# EAGLE design power (EAGLE 7.6.0)
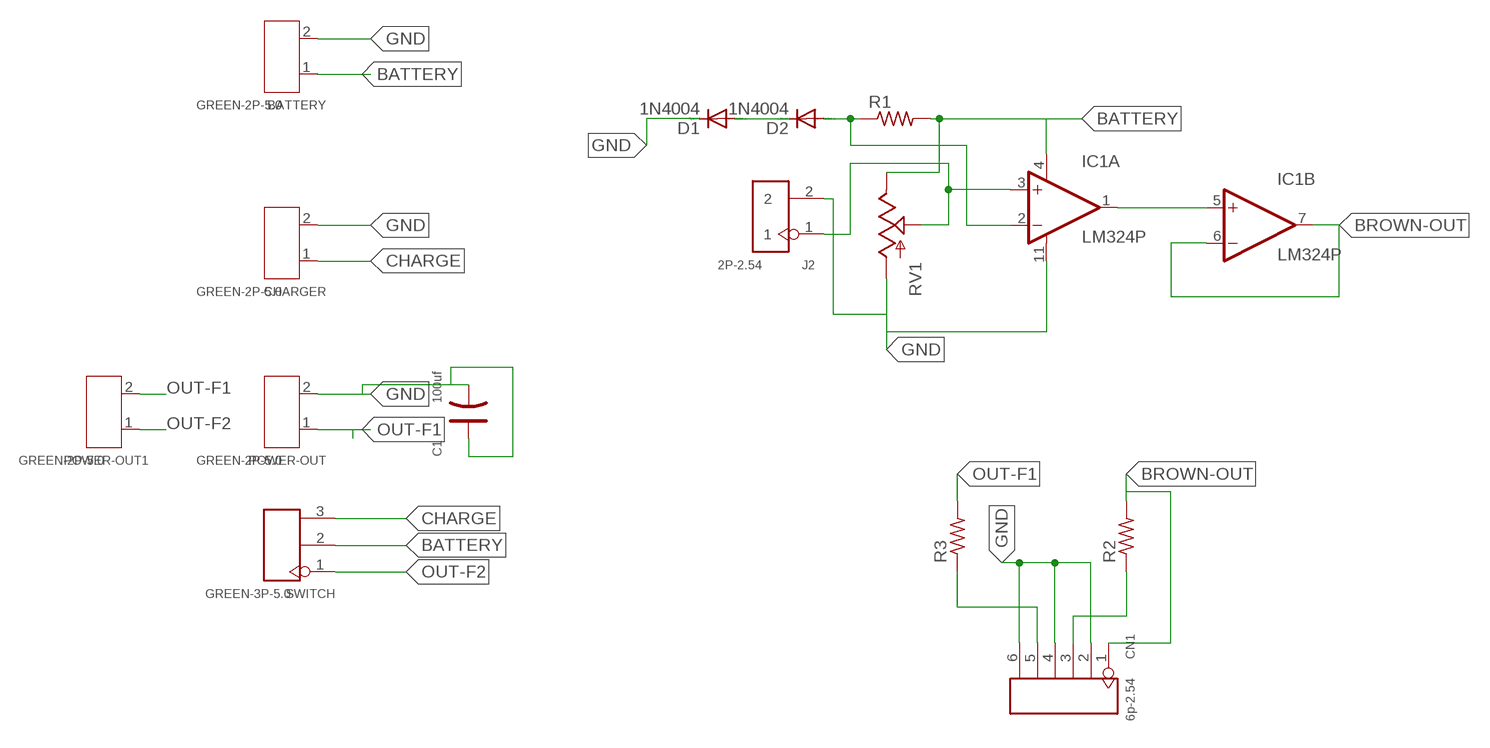
[diagram p0: schematic, sheet 1]

## Parts
BATTERY  GREEN-2P-5.0  SCREW-TERMINAL-GREEN(2P-5.0)  [H2-5.0-10.5X8.0MM]
C1  100uf  DIP-ALUMINUM-100UF-16V(D5-H7MM)  [PC-D5.3MM]
CHARGER  GREEN-2P-5.0  SCREW-TERMINAL-GREEN(2P-5.0)  [H2-5.0-10.5X8.0MM]
CN1  6p-2.54  DIP-BLACK-FEMALE-HEADER-VERT(6P-2.54)  [H6-2.54]
D1  1N4004  [DO41-10]
D2  1N4004  [DO41-10]
IC1  LM324P  [DIL14]
J2  2P-2.54  DIP-WHITE-MALE-HEADER-VERT(2P-2.54)  [H2-2.54]
POWER-OUT  GREEN-2P-5.0  SCREW-TERMINAL-GREEN(2P-5.0)  [H2-5.0-10.5X8.0MM]
POWER-OUT1  GREEN-2P-5.0  SCREW-TERMINAL-GREEN(2P-5.0)  [H2-5.0-10.5X8.0MM]
R1  R-US_0207/10  [0207/10]
R2  R-US_0207/10  [0207/10]
R3  R-US_0207/10  [0207/10]
RV1  POTTRIM  [TRIM_POT]
SWITCH  GREEN-3P-5.0  SCREW-TERMINAL-GREEN(3P-5.0)  [H3-5.0-15.5X8.0MM]

## Nets
BATTERY: BATTERY.1 IC1.4(A:V+) R1.2 RV1.2(E) SWITCH.2
BROWN-OUT: CN1.1 IC1.6(B:-IN) IC1.7(B:OUT) R2.2
CHARGE: CHARGER.1 SWITCH.3
GND: BATTERY.2 C1.+ C1.- CHARGER.2 CN1.2 CN1.4 CN1.6 D1.C IC1.11(A:V-) J2.2 POWER-OUT.2 RV1.3(A)
N$1: CN1.5 R3.1
N$2: D1.A D2.C
N$3: D2.A IC1.2(A:-IN) R1.1
N$4: IC1.3(A:+IN) J2.1 RV1.1(S)
N$5: IC1.1(A:OUT) IC1.5(B:+IN)
N$6: CN1.3 R2.1
OUT-F1: POWER-OUT1.2 POWER-OUT.1 R3.2
OUT-F2: POWER-OUT1.1 SWITCH.1
Unconnected: IC1.8(C:OUT) IC1.9(C:-IN) IC1.10(C:+IN) IC1.12(D:+IN) IC1.13(D:-IN) IC1.14(D:OUT)

## Library data of the parts
BATTERY CHARGER POWER-OUT POWER-OUT1 = Seeed-Connector -2016:SCREW-TERMINAL-GREEN(2P-5.0): 320110031
C1 = Seeed-Capacitor-2016:DIP-ALUMINUM-100UF-16V(D5-H7MM): 302030031; MPN: KS 100uF/16V
CN1 = Seeed-Connector -2016:DIP-BLACK-FEMALE-HEADER-VERT(6P-2.54): 320030060; MPN: F185-1106A1BSYC1
D1 D2 = diode:1N4004: DIODE general purpose rectifier, 1 A
IC1 = lm324:LM324: Low Power, Precision FET-Input Operational Amplifiers
J2 = Seeed-Connector -2016:DIP-WHITE-MALE-HEADER-VERT(2P-2.54): 320020037; MPN: P125-1102A0BS116A3
R1-R3 = adafruit:R-US_: RESISTOR, American symbol
RV1 = SparkFun-Electromechanical:POT
SWITCH = Seeed-Connector -2016:SCREW-TERMINAL-GREEN(3P-5.0): 320110029

## Board
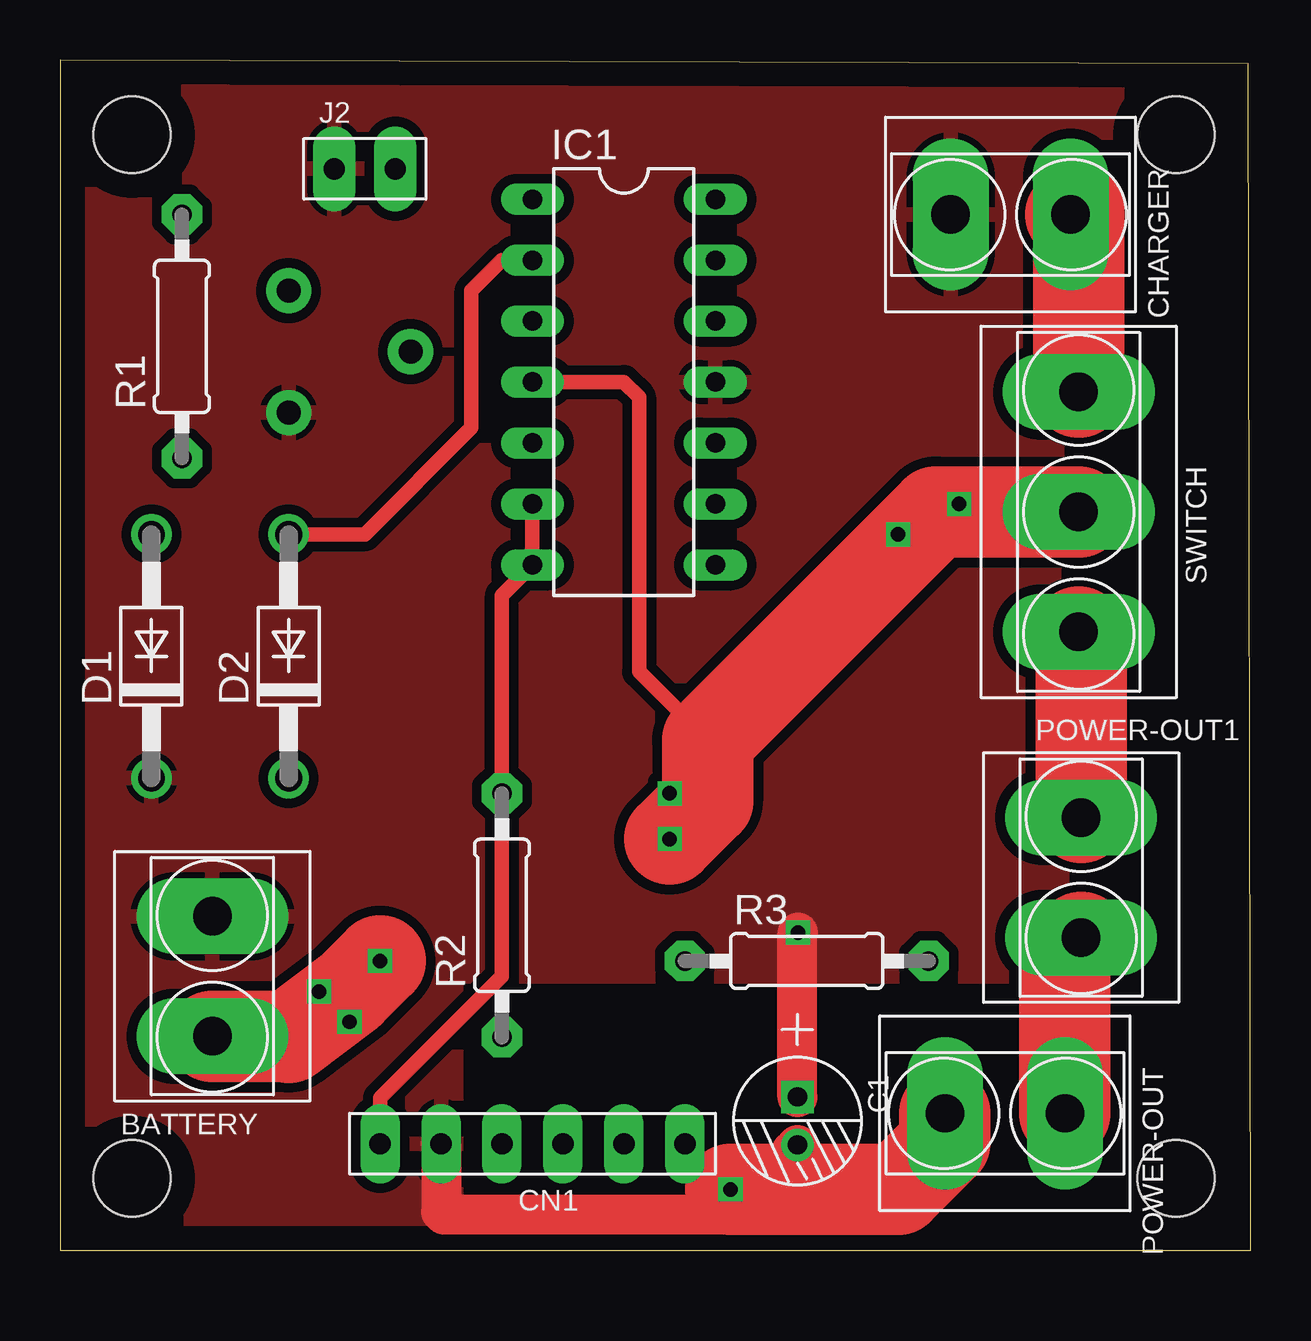
[diagram p1: board, top side]
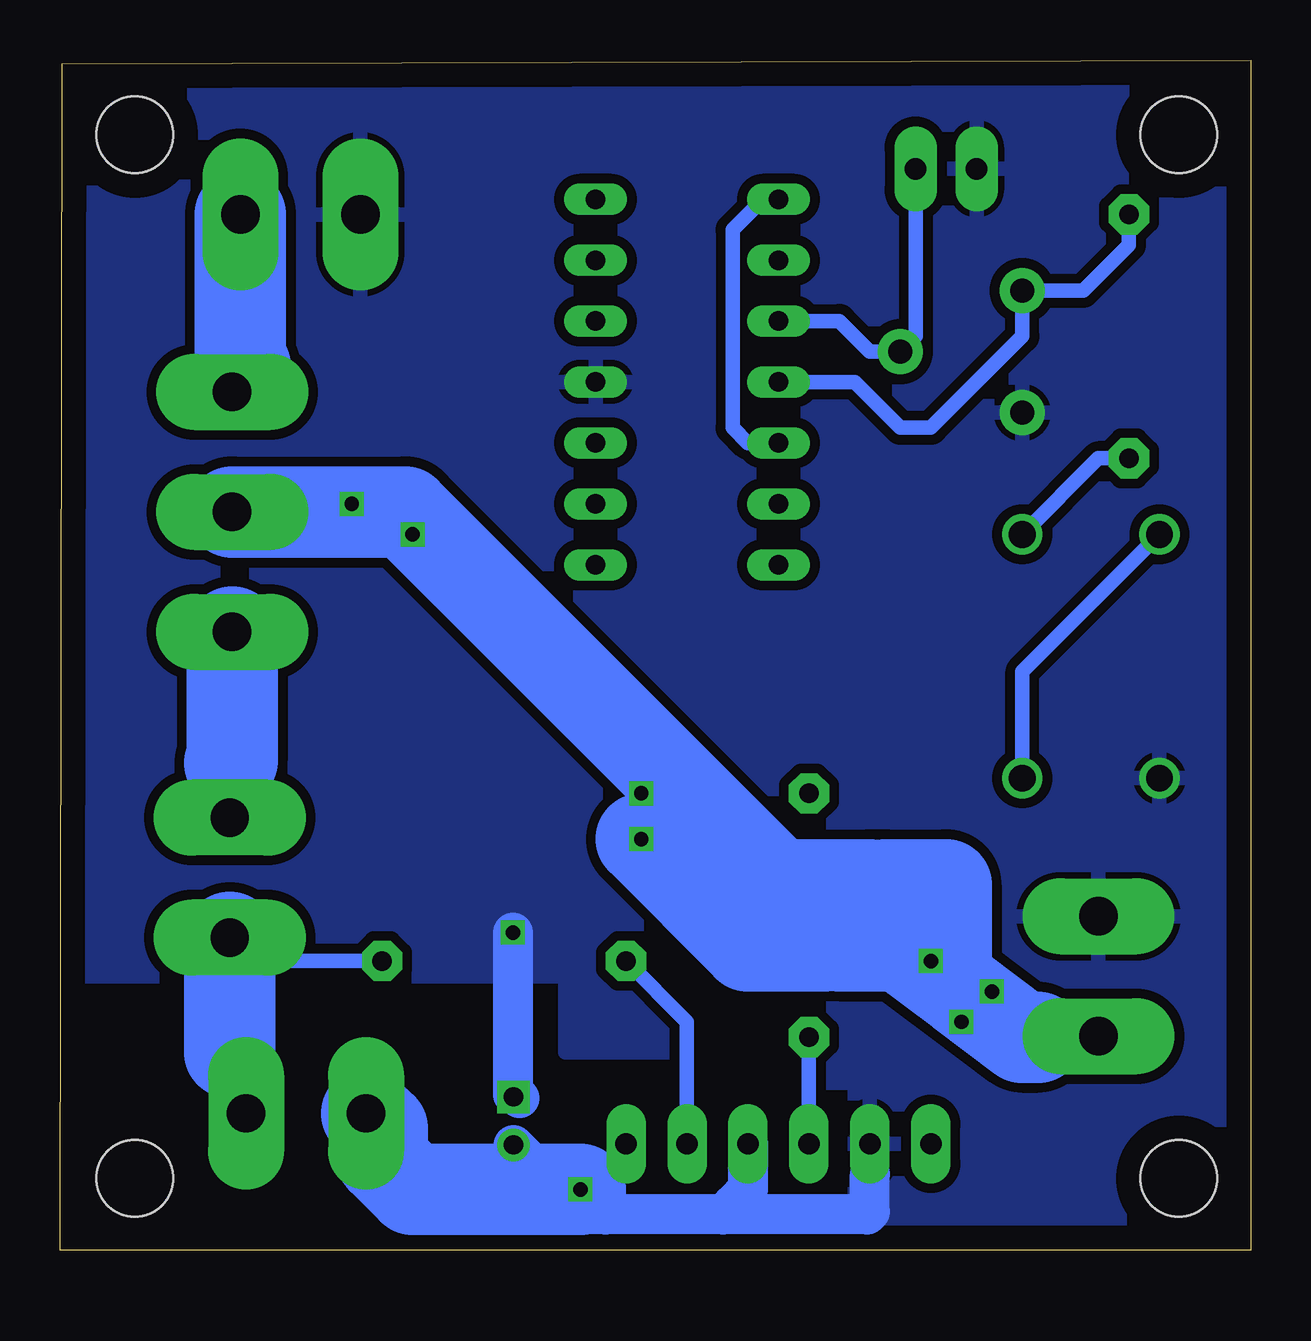
[diagram p2: board, bottom side, seen from below]

Size 49.62 x 49.62 mm. Coordinates in mm from the lower left corner, seen from the top.
Outline: 0,0 49.62,0 49.52,49.47 0,49.62 0,0
Copper layers (1*16): Top 0.035mm / dielectric 1.5mm / Bottom 0.035mm
Design rules "default": minimum track width 10mil, minimum drill 24mil, track to track 8mil, track to pad 8mil, pad to pad 8mil, via to via 8mil, smd to smd 8mil, copper to edge 40mil, drill to drill 8mil, minimum pad ring 10mil, minimum via ring 8mil, stop-mask expansion 4mil, vias tented up to drill 0mil, thermal gap 10mil
Holes 3.2 mm at 3,3 3,46.5 46.5,46.5 46.5,3

### Footprints (pad centres in the part's own frame; a part is rotated, then mirrored left to right if it is on the bottom)
H2-5.0-10.5X8.0MM = drill 1.6 pad 3.175 long: 1 0,2.5; 2 0,-2.5
PC-D5.3MM = drill 0.8 pad 1.35 square: + -1,0 | drill 0.8 pad 1.35: - 1,0
H6-2.54 = drill 0.889 pad 1.651 long: 1 0,6.35; 2 0,3.81; 3 0,1.27; 4 0,-1.27; 5 0,-3.81; 6 0,-6.35
DO41-10 = drill 1.118: A 5.08,0; C -5.08,0
DIL14 = drill 0.813 long: 1 -7.62,-3.81; 2 -5.08,-3.81; 3 -2.54,-3.81; 4 0,-3.81; 5 2.54,-3.81; 6 5.08,-3.81; 7 7.62,-3.81; 8 7.62,3.81; 9 5.08,3.81; 10 2.54,3.81; 11 0,3.81; 12 -2.54,3.81; 13 -5.08,3.81; 14 -7.62,3.81
H2-2.54 = drill 0.889 pad 1.778 long: 1 0,1.27; 2 0,-1.27
0207/10 = drill 0.813 pad 1.676 octagon: 1 -5.08,0; 2 5.08,0
TRIM_POT = drill 1 pad 1.88: 1 5.08,0; 2 0,2.54; 3 0,-2.54
H3-5.0-15.5X8.0MM = drill 1.6 pad 3.175 long: 1 0,5; 2 0,0; 3 0,-5

### Placement (x,y rotation side)
BATTERY  6.35,11.43 180 top
C1  30.73,5.39 270 top
CHARGER  39.6,43.18 270 top
CN1  19.68,4.45 90 top
D1  3.81,24.77 90 top
D2  9.53,24.77 90 top
IC1  23.5,36.2 270 top
J2  12.7,45.09 270 top
POWER-OUT  39.37,5.71 270 top
POWER-OUT1  42.55,15.54 0 top
R1  5.08,38.1 90 top
R2  18.41,13.97 90 top
R3  31.11,12.06 0 top
RV1  9.53,37.47 0 top
SWITCH  42.45,30.78 180 top

### Tracks (layer width: path | path; a pad name or v marks a point on that pad's centre or on a via)
BATTERY  (via drill 0.6)
  Top 0.61: IC1.4 23.5,36.2 24.13,35.56 24.13,24.13 26.99,21.27
  Top 3.81: BATTERY.1 9.48,8.93 9.53,8.89 12.06,10.79 v13.34,12.06 | SWITCH.2 36.49,30.78 26.99,21.27 26.99,18.73 v25.4,17.14
  Bottom 0.61: R1.2 5.08,41.91 6.99,40.01 RV1.2 9.53,38.1 13.34,34.29 14.61,34.29 16.51,36.2 IC1.4
  Bottom 3.81: SWITCH.2 35.23,30.78 19.68,15.24 | 17.78,13.34 17.14,12.7 14.61,12.7 | 14.61,12.7 12.06,10.79 | 12.06,10.79 9.53,8.89 8.89,8.89 | v25.4,17.14 20.95,12.7 17.78,12.7 17.78,13.34 | 17.78,13.34 19.68,15.24 | 19.68,15.24 15.88,15.24 14.61,13.97 14.61,14.61 15.24,15.24 12.7,15.24 12.7,11.43 12.06,10.79 | 14.61,12.7 13.97,12.7 v13.34,12.06
BROWN-OUT
  Top 0.61: IC1.6 IC1.7 18.41,27.3 R2.2 18.41,11.43 13.34,6.35 CN1.1
CHARGE
  Top 3.81: SWITCH.3 42.45,43.48 CHARGER.1
  Bottom 3.81: CHARGER.1 42.1,37.02 41.91,36.83
GND  (via drill 0.6)
  Top 1.676: CN1.2 15.88,1.62 16,1.5 30.07,1.5 30.48,1.91 30.48,4.15 C1.- | C1.+ 30.73,13.22 v30.75,13.25
  Top 3.81: POWER-OUT.2 36.87,4.49 34.92,2.54 v27.94,2.54
  Bottom 1.27: CN1.6 26.04,3.81 26.67,3.17 29.5,3.17 C1.-
  Bottom 1.676: CN1.4 20.95,2.54 21.59,1.91 22,1.5 28.8,1.5 29.21,1.91 | 29.21,1.91 28.57,1.91 v27.94,2.54 26.9,1.5 16,1.5 15.88,1.62 15.88,3.17 | 29.21,1.91 29.21,2.88 C1.- | v30.75,13.25 30.75,6.5 30.63,6.5 30.48,6.35
  Bottom 3.81: v27.94,2.54 34.92,2.54 36.2,3.81 36.2,5.08 36.83,5.71
  pour Bottom (isolate 0.406): -0.64,50.16 50.16,50.16 50.16,11.43 28.57,11.43 28.57,8.26 20.32,8.26 20.32,6.99 16.51,6.99 16.51,-0.64 -0.64,-0.64
  pour Top (isolate 0.406): -1.91,0 -1.91,50.16 52.07,50.16 52.07,36.83 51.44,36.83 51.44,11.43 16.51,11.43 16.51,-1.91 -1.91,-1.91
N$1
  Bottom 0.61: CN1.5 23.5,9.53 R3.1
N$2
  Bottom 0.61: D2.C 9.53,24.13 D1.A
N$3
  Top 0.61: D2.A 12.7,29.84 17.14,34.29 17.14,40.01 18.41,41.27 IC1.2
  Bottom 0.61: R1.1 6.35,33.02 D2.A
N$4
  Bottom 0.61: J2.1 13.97,38.1 RV1.1 15.88,37.47 17.14,38.73 IC1.3
N$5
  Bottom 0.61: IC1.1 20.32,43.81 21.59,42.55 21.59,34.29 20.95,33.66 IC1.5
N$6
  Bottom 0.61: R2.1 CN1.3
N$7  (via drill 0.6)
  other vias: 25.4,19.05
N$8  (via drill 0.6)
  other vias: 10.79,10.79
N$9  (via drill 0.6)
  other vias: 37.47,31.11
N$10  (via drill 0.6)
  other vias: 34.92,29.84
N$11  (via drill 0.6)
  other vias: 12.06,9.53
OUT-F1
  Top 3.81: POWER-OUT.1 41.87,12.37 POWER-OUT1.2
  Bottom 0.61: R3.2 42.55,12.06
  Bottom 3.81: POWER-OUT1.2 42.55,12.06 42.55,8.26
OUT-F2
  Top 3.81: POWER-OUT1.1 42.55,25.68 SWITCH.1
  Bottom 3.81: SWITCH.1 42.45,20.42 42.55,20.32

### Text on the board
silktop: GND | VCC | CHARGE | CHARGE | BATT | 3-WAY / SWITCH | OUT | BATTERY / POWER BOARD | GND/B- | FUSE~ | B+ | POWER / OUT | BATTERY | 0v | 0v | BO / Signal | ON / LED | 0v | GND | VCC | BO / LED